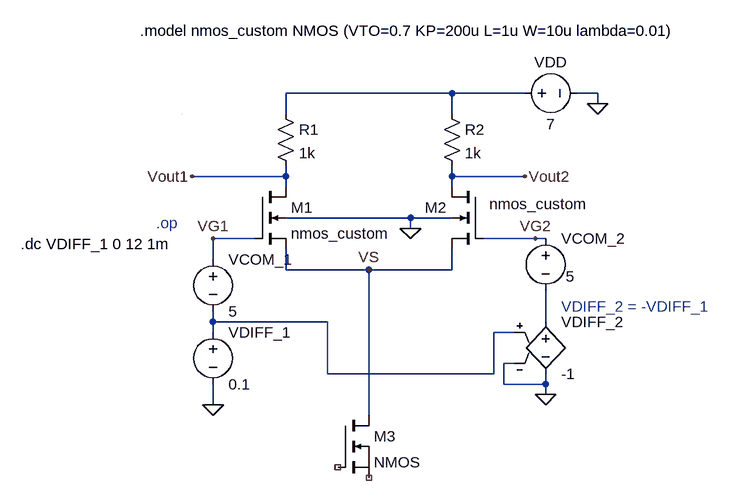
[diagram p0: schematic diffamp_diff.asc]
diffamp_diff.asc, the LTspice schematic file:
Version 4.1
SHEET 1 880 680
WIRE 416 -32 160 -32
WIRE 528 -32 416 -32
WIRE 640 -32 608 -32
WIRE 640 -16 640 -32
WIRE 160 0 160 -32
WIRE 416 0 416 -32
WIRE 160 96 160 80
WIRE 160 96 16 96
WIRE 416 96 416 80
WIRE 528 96 416 96
WIRE 160 112 160 96
WIRE 416 112 416 96
WIRE 352 160 160 160
WIRE 416 160 352 160
WIRE 352 176 352 160
WIRE 112 192 48 192
WIRE 544 192 464 192
WIRE 560 192 544 192
WIRE 48 224 48 192
WIRE 160 240 160 208
WIRE 288 240 160 240
WIRE 416 240 416 208
WIRE 416 240 288 240
WIRE 48 320 48 304
WIRE 224 320 48 320
WIRE 560 320 560 272
WIRE 48 336 48 320
WIRE 512 336 480 336
WIRE 512 384 496 384
WIRE 224 400 224 320
WIRE 480 400 480 336
WIRE 480 400 224 400
WIRE 496 416 496 384
WIRE 560 416 560 400
WIRE 560 416 496 416
WIRE 560 432 560 416
WIRE 48 448 48 416
WIRE 288 464 288 240
WIRE 0 0 0 0
FLAG 16 96 Vout1
FLAG 528 96 Vout2
FLAG 288 240 VS
FLAG 640 -16 0
FLAG 560 432 0
FLAG 48 448 0
FLAG 48 192 VG1
FLAG 544 192 VG2
FLAG 352 176 0
SYMBOL voltage 48 208 R0
WINDOW 123 0 0 Left 0
WINDOW 39 0 0 Left 0
SYMATTR InstName VCOM_1
SYMATTR Value 5
SYMBOL res 144 -16 R0
SYMATTR InstName R1
SYMATTR Value 1k
SYMBOL res 400 -16 R0
SYMATTR InstName R2
SYMATTR Value 1k
SYMBOL voltage 512 -32 R270
WINDOW 0 32 56 VTop 2
WINDOW 3 -32 56 VBottom 2
WINDOW 123 0 0 Left 0
WINDOW 39 0 0 Left 0
SYMATTR InstName VDD
SYMATTR Value 7
SYMBOL e 560 304 R0
SYMATTR InstName VDIFF_2
SYMATTR Value -1
SYMBOL voltage 560 176 R0
WINDOW 3 31 74 Left 2
WINDOW 123 0 0 Left 0
WINDOW 39 0 0 Left 0
SYMATTR Value 5
SYMATTR InstName VCOM_2
SYMBOL voltage 48 320 R0
WINDOW 123 0 0 Left 0
WINDOW 39 0 0 Left 0
SYMATTR InstName VDIFF_1
SYMATTR Value 0.1
SYMBOL nmos4 112 112 R0
SYMATTR InstName M1
SYMATTR Value nmos_custom
SYMBOL nmos4 464 112 M0
WINDOW 3 -160 27 Left 2
SYMATTR Value nmos_custom
SYMATTR InstName M2
SYMBOL nmos 240 464 R0
SYMATTR InstName M3
TEXT -40 168 Left 2 ;.op
TEXT 584 296 Left 2 ;VDIFF_2 = -VDIFF_1
TEXT -248 200 Left 2 !.dc VDIFF_1 0 12 1m
TEXT -64 -128 Left 2 !.model nmos_custom NMOS (VTO=0.7 KP=200u L=1u W=10u lambda=0.01)

The netlist it stands for:
* diffamp_diff.asc
VCOM_1 VG1 N002 5
R1 N001 Vout1 1k
R2 N001 Vout2 1k
VDD N001 0 7
E§VDIFF_2 N003 0 N002 0 -1
VCOM_2 VG2 N003 5
VDIFF_1 N002 0 0.1
M1 Vout1 VG1 VS 0 nmos_custom
M2 Vout2 VG2 VS 0 nmos_custom
M3 VS NC_01 NC_02 NC_02 NMOS
.model NMOS NMOS
.model PMOS PMOS
.lib standard.mos
* .op
* VDIFF_2 = -VDIFF_1
.dc VDIFF_1 0 12 1m
.model nmos_custom NMOS (VTO=0.7 KP=200u L=1u W=10u lambda=0.01)
.backanno
.end